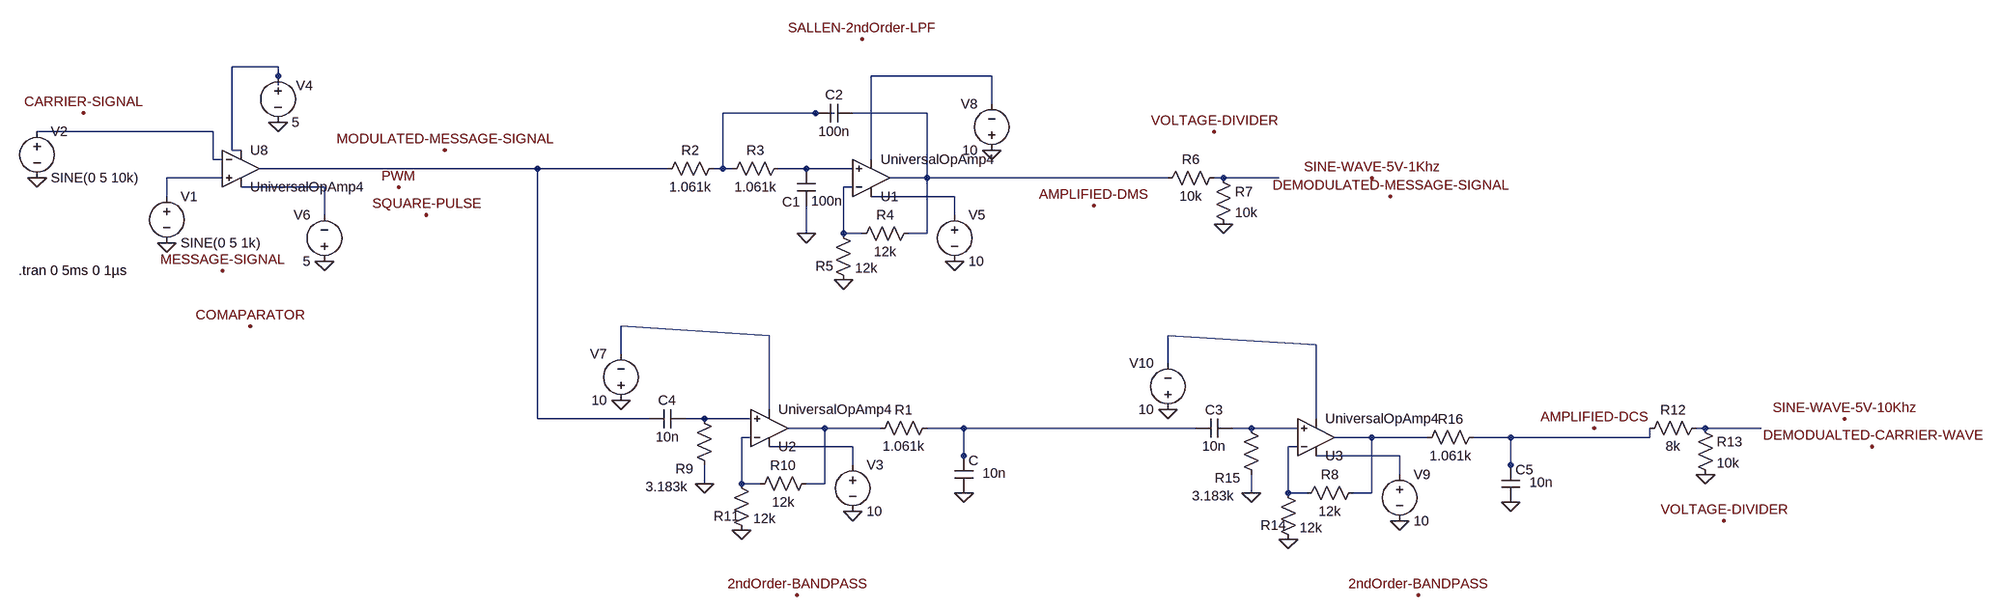
[diagram p0: schematic PWM.asc]
PWM.asc, the LTspice schematic file:
Version 4
SHEET 1 3088 916
WIRE 128 -80 48 -80
WIRE 128 -64 128 -80
WIRE 1360 -64 1152 -64
WIRE 128 -48 128 -64
WIRE 1360 -16 1360 -64
WIRE 1056 0 896 0
WIRE 1088 0 1056 0
WIRE 1248 0 1120 0
WIRE 16 32 -288 32
WIRE 48 64 48 -80
WIRE 64 64 48 64
WIRE 16 80 16 32
WIRE 32 80 16 80
WIRE 1152 80 1152 -64
WIRE 576 96 96 96
WIRE 800 96 576 96
WIRE 896 96 896 0
WIRE 896 96 880 96
WIRE 912 96 896 96
WIRE 1040 96 992 96
WIRE 1120 96 1040 96
WIRE 32 112 -64 112
WIRE 1248 112 1248 0
WIRE 1248 112 1184 112
WIRE 1664 112 1248 112
WIRE 1760 112 1744 112
WIRE 1856 112 1760 112
WIRE 208 128 64 128
WIRE 1120 128 1104 128
WIRE -64 144 -64 112
WIRE 1296 144 1152 144
WIRE 208 176 208 128
WIRE 1296 176 1296 144
WIRE 1040 208 1040 160
WIRE 1104 208 1104 128
WIRE 1136 208 1104 208
WIRE 1248 208 1248 112
WIRE 1248 208 1216 208
WIRE 976 384 720 368
WIRE 1920 400 1664 384
WIRE 720 416 720 368
WIRE 1664 432 1664 384
WIRE 976 512 976 384
WIRE 576 528 576 96
WIRE 768 528 576 528
WIRE 864 528 832 528
WIRE 944 528 864 528
WIRE 1920 528 1920 400
WIRE 1072 544 1008 544
WIRE 1168 544 1072 544
WIRE 1312 544 1248 544
WIRE 1712 544 1312 544
WIRE 1808 544 1776 544
WIRE 1888 544 1808 544
WIRE 2592 544 2576 544
WIRE 2688 544 2592 544
WIRE 944 560 928 560
WIRE 2016 560 1952 560
WIRE 2112 560 2016 560
WIRE 2256 560 2192 560
WIRE 2496 560 2496 544
WIRE 2496 560 2256 560
WIRE 1120 576 976 576
WIRE 1888 576 1872 576
WIRE 1312 592 1312 544
WIRE 2064 592 1920 592
WIRE 1120 608 1120 576
WIRE 1312 608 1312 592
WIRE 2256 608 2256 560
WIRE 2064 624 2064 592
WIRE 2256 624 2256 608
WIRE 864 640 864 608
WIRE 928 640 928 560
WIRE 960 640 928 640
WIRE 1072 640 1072 544
WIRE 1072 640 1040 640
WIRE 1808 656 1808 624
WIRE 1872 656 1872 576
WIRE 1904 656 1872 656
WIRE 2016 656 2016 560
WIRE 2016 656 1984 656
FLAG -288 112 0
FLAG -64 224 0
FLAG 128 16 0
FLAG 336 128 PWM
FLAG 1040 208 0
FLAG 1104 288 0
FLAG 1296 256 0
FLAG 1536 160 AMPLIFIED-DMS
FLAG 2048 144 DEMODULATED-MESSAGE-SIGNAL
FLAG 1760 192 0
FLAG 864 640 0
FLAG 928 720 0
FLAG 1120 688 0
FLAG 2880 576 DEMODUALTED-CARRIER-WAVE
FLAG 2592 624 0
FLAG 208 256 0
FLAG 1360 64 0
FLAG 720 496 0
FLAG 1312 656 0
FLAG 1808 656 0
FLAG 1872 736 0
FLAG 2064 704 0
FLAG 1664 512 0
FLAG 2256 672 0
FLAG 2016 112 SINE-WAVE-5V-1Khz
FLAG 2832 528 SINE-WAVE-5V-10Khz
FLAG 416 64 MODULATED-MESSAGE-SIGNAL
FLAG 384 176 SQUARE-PULSE
FLAG 2400 544 AMPLIFIED-DCS
FLAG 80 368 COMAPARATOR
FLAG 1136 -128 SALLEN-2ndOrder-LPF
FLAG 1744 32 VOLTAGE-DIVIDER
FLAG 2624 704 VOLTAGE-DIVIDER
FLAG 1024 832 2ndOrder-BANDPASS
FLAG 2096 832 2ndOrder-BANDPASS
FLAG 32 272 MESSAGE-SIGNAL
FLAG -208 0 CARRIER-SIGNAL
SYMBOL voltage -64 128 R0
WINDOW 123 24 124 Left 2
WINDOW 39 0 0 Left 0
SYMATTR InstName V1
SYMATTR Value SINE(0 5 1k)
SYMBOL voltage -288 16 R0
WINDOW 123 24 124 Left 2
WINDOW 39 0 0 Left 0
SYMATTR InstName V2
SYMATTR Value SINE(0 5 10k)
SYMBOL voltage 128 -80 R0
WINDOW 0 31 33 Left 2
WINDOW 123 0 0 Left 0
WINDOW 39 0 0 Left 0
SYMATTR InstName V4
SYMATTR Value 5
SYMBOL OpAmps\\UniversalOpAmp4 64 96 R0
SYMATTR InstName U8
SYMBOL res 896 80 R90
WINDOW 0 0 56 VBottom 2
WINDOW 3 32 56 VTop 2
SYMATTR InstName R2
SYMATTR Value 1.061k
SYMBOL res 1008 80 R90
WINDOW 0 0 56 VBottom 2
WINDOW 3 32 56 VTop 2
SYMATTR InstName R3
SYMATTR Value 1.061k
SYMBOL cap 1024 96 R0
WINDOW 0 -10 73 Bottom 2
SYMATTR InstName C1
SYMATTR Value 100n
SYMBOL cap 1120 -16 R90
WINDOW 0 0 32 VBottom 2
WINDOW 3 32 32 VTop 2
SYMATTR InstName C2
SYMATTR Value 100n
SYMBOL OpAmps\\UniversalOpAmp4 1152 112 M180
SYMATTR InstName U1
SYMBOL res 1232 192 R90
WINDOW 0 0 56 VBottom 2
WINDOW 3 32 56 VTop 2
SYMATTR InstName R4
SYMATTR Value 12k
SYMBOL res 1088 192 R0
WINDOW 0 -32 72 Left 2
SYMATTR InstName R5
SYMATTR Value 12k
SYMBOL voltage 1296 160 R0
WINDOW 123 0 0 Left 0
WINDOW 39 0 0 Left 0
SYMATTR InstName V5
SYMATTR Value 10
SYMBOL res 1760 96 R90
WINDOW 0 0 56 VBottom 2
WINDOW 3 32 56 VTop 2
SYMATTR InstName R6
SYMATTR Value 10k
SYMBOL res 1744 96 R0
SYMATTR InstName R7
SYMATTR Value 10k
SYMBOL OpAmps\\UniversalOpAmp4 976 544 M180
SYMATTR InstName U2
SYMBOL res 1056 624 R90
WINDOW 0 0 56 VBottom 2
WINDOW 3 32 56 VTop 2
SYMATTR InstName R10
SYMATTR Value 12k
SYMBOL res 912 624 R0
WINDOW 0 -32 72 Left 2
SYMATTR InstName R11
SYMATTR Value 12k
SYMBOL voltage 1120 592 R0
WINDOW 123 0 0 Left 0
WINDOW 39 0 0 Left 0
SYMATTR InstName V3
SYMATTR Value 10
SYMBOL res 2592 528 R90
WINDOW 0 0 56 VBottom 2
WINDOW 3 32 56 VTop 2
SYMATTR InstName R12
SYMATTR Value 8k
SYMBOL res 2576 528 R0
SYMATTR InstName R13
SYMATTR Value 10k
SYMBOL res 880 624 R180
WINDOW 0 35 10 Left 2
WINDOW 3 45 -21 Left 2
SYMATTR InstName R9
SYMATTR Value 3.183k
SYMBOL cap 832 512 R90
WINDOW 0 0 32 VBottom 2
WINDOW 3 32 32 VTop 2
SYMATTR InstName C4
SYMATTR Value 10n
SYMBOL voltage 208 272 R180
WINDOW 0 24 96 Left 2
WINDOW 3 24 16 Left 2
WINDOW 123 0 0 Left 0
WINDOW 39 0 0 Left 0
SYMATTR InstName V6
SYMATTR Value 5
SYMBOL voltage 1360 80 R180
WINDOW 0 24 96 Left 2
WINDOW 3 24 16 Left 2
WINDOW 123 0 0 Left 0
WINDOW 39 0 0 Left 0
SYMATTR InstName V8
SYMATTR Value 10
SYMBOL voltage 720 512 R180
WINDOW 0 24 96 Left 2
WINDOW 3 24 16 Left 2
WINDOW 123 0 0 Left 0
WINDOW 39 0 0 Left 0
SYMATTR InstName V7
SYMATTR Value 10
SYMBOL res 1264 528 R90
WINDOW 0 0 56 VBottom 2
WINDOW 3 32 56 VTop 2
SYMATTR InstName R1
SYMATTR Value 1.061k
SYMBOL cap 1296 592 R0
WINDOW 3 48 30 Left 2
SYMATTR Value 10n
SYMATTR InstName C
SYMBOL OpAmps\\UniversalOpAmp4 1920 560 M180
SYMATTR InstName U3
SYMBOL res 2000 640 R90
WINDOW 0 0 56 VBottom 2
WINDOW 3 32 56 VTop 2
SYMATTR InstName R8
SYMATTR Value 12k
SYMBOL res 1856 640 R0
WINDOW 0 -32 72 Left 2
SYMATTR InstName R14
SYMATTR Value 12k
SYMBOL voltage 2064 608 R0
WINDOW 123 0 0 Left 0
WINDOW 39 0 0 Left 0
SYMATTR InstName V9
SYMATTR Value 10
SYMBOL res 1824 640 R180
WINDOW 0 35 10 Left 2
WINDOW 3 45 -21 Left 2
SYMATTR InstName R15
SYMATTR Value 3.183k
SYMBOL cap 1776 528 R90
WINDOW 0 0 32 VBottom 2
WINDOW 3 32 32 VTop 2
SYMATTR InstName C3
SYMATTR Value 10n
SYMBOL voltage 1664 528 R180
WINDOW 0 24 96 Left 2
WINDOW 3 24 16 Left 2
WINDOW 123 0 0 Left 0
WINDOW 39 0 0 Left 0
SYMATTR InstName V10
SYMATTR Value 10
SYMBOL res 2208 544 R90
WINDOW 0 0 56 VBottom 2
WINDOW 3 32 56 VTop 2
SYMATTR InstName R16
SYMATTR Value 1.061k
SYMBOL cap 2240 608 R0
WINDOW 3 48 30 Left 2
SYMATTR Value 10n
SYMATTR InstName C5
TEXT -320 272 Left 2 !.tran 0 5ms 0 1µs

The netlist it stands for:
* PWM.asc
V1 N008 0 SINE(0 5 1k)
V2 N005 0 SINE(0 5 10k)
V4 N001 0 5
* U8: UniversalOpAmp4 (symbol OpAmps\UniversalOpAmp4 not available, pins judged from their places): In+=N008 In-=N005 V+=N001 V-=N010 OUT=N006
R2 N003 N006 1.061k
R3 N007 N003 1.061k
C1 N007 0 100n
C2 N004 N003 100n
* U1: UniversalOpAmp4 (symbol OpAmps\UniversalOpAmp4 not available, pins judged from their places): In+=N007 In-=N011 V+=N012 V-=N002 OUT=N004
R4 N004 N011 12k
R5 N011 0 12k
V5 N012 0 10
R6 N009 N004 10k
R7 N009 0 10k
* U2: UniversalOpAmp4 (symbol OpAmps\UniversalOpAmp4 not available, pins judged from their places): In+=N015 In-=N020 V+=N023 V-=N013 OUT=N016
R10 N016 N020 12k
R11 N020 0 12k
V3 N023 0 10
R12 N019 N022 8k
R13 N019 0 10k
R9 0 N015 3.183k
C4 N015 N006 10n
V6 0 N010 5
V8 0 N002 10
V7 0 N013 10
R1 N017 N016 1.061k
C N017 0 10n
* U3: UniversalOpAmp4 (symbol OpAmps\UniversalOpAmp4 not available, pins judged from their places): In+=N018 In-=N024 V+=N025 V-=N014 OUT=N021
R8 N021 N024 12k
R14 N024 0 12k
V9 N025 0 10
R15 0 N018 3.183k
C3 N018 N017 10n
V10 0 N014 10
R16 N022 N021 1.061k
C5 N022 0 10n
.tran 0 5ms 0 1µs
.backanno
.end